# EasyEDA Pro project miniMQ.epro, schematic ArtNet-ETH
Board Name: ArtNet-ETH; Create Date: 2026-09-25; Page Name: P1; Project Name: MagicQ Compact Mini Connect; Schematic Name: ArtNet-ETH; Update Date: 2026-09-25; Company: EasyEDA.com; Page Size: A4; Version: V1.0
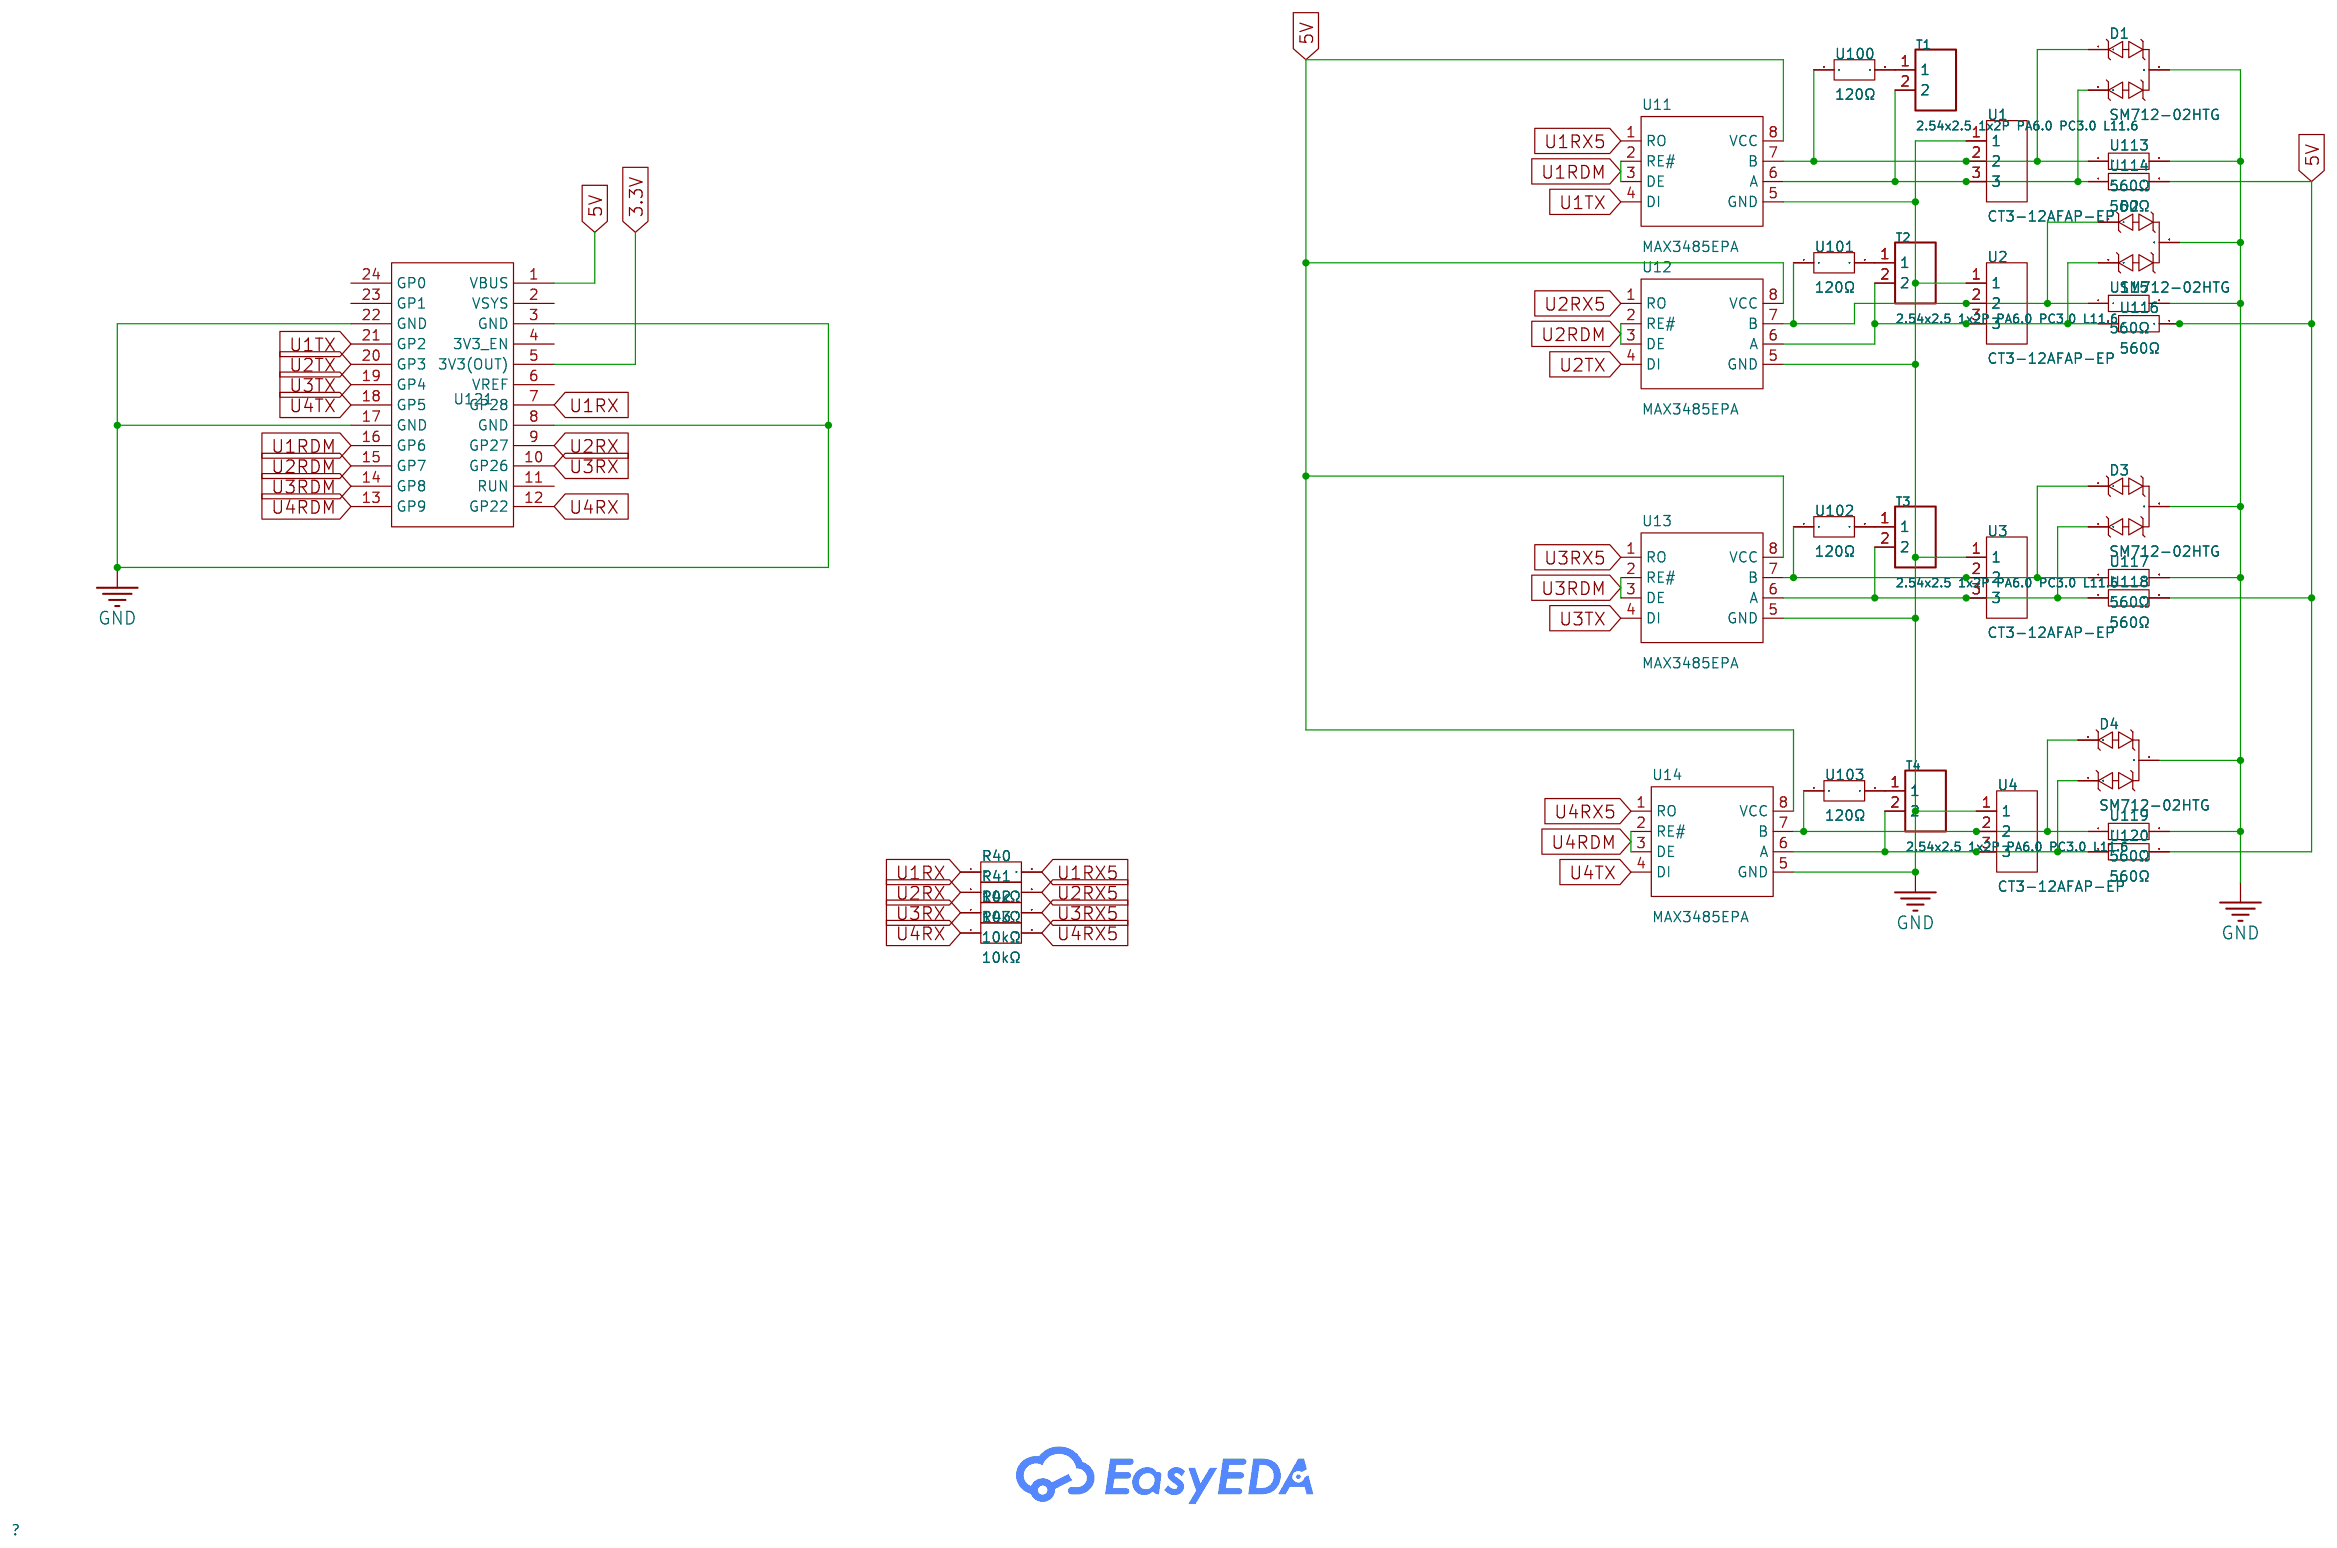
[diagram p8: schematic sheet]

## Parts
D1  SM712-02HTG  [SOT-23-3_L2.9-W1.3-P1.90-LS2.4-BR]
D2  SM712-02HTG  [SOT-23-3_L2.9-W1.3-P1.90-LS2.4-BR]
D3  SM712-02HTG  [SOT-23-3_L2.9-W1.3-P1.90-LS2.4-BR]
D4  SM712-02HTG  [SOT-23-3_L2.9-W1.3-P1.90-LS2.4-BR]
R40  10kΩ  [RES-TH_BD2.3-L3.7-P7.70-D0.9]
R41  10kΩ  [RES-TH_BD2.3-L3.7-P7.70-D0.9]
R42  10kΩ  [RES-TH_BD2.3-L3.7-P7.70-D0.9]
R43  10kΩ  [RES-TH_BD2.3-L3.7-P7.70-D0.9]
T1  2.54x2.5 1x2P PA6.0 PC3.0 L11.6  [HDR-TH_2P-P2.54-V-M-R2-C1-S2.54_3]
T2  2.54x2.5 1x2P PA6.0 PC3.0 L11.6  [HDR-TH_2P-P2.54-V-M-R2-C1-S2.54_3]
T3  2.54x2.5 1x2P PA6.0 PC3.0 L11.6  [HDR-TH_2P-P2.54-V-M-R2-C1-S2.54_3]
T4  2.54x2.5 1x2P PA6.0 PC3.0 L11.6  [HDR-TH_2P-P2.54-V-M-R2-C1-S2.54_3]
U1  CT3-12AFAP-EP  [CONN-TH_CT3-12AFAP-EP]
U2  CT3-12AFAP-EP  [CONN-TH_CT3-12AFAP-EP]
U3  CT3-12AFAP-EP  [CONN-TH_CT3-12AFAP-EP]
U4  CT3-12AFAP-EP  [CONN-TH_CT3-12AFAP-EP]
U11  MAX3485EPA  [DIP-8_L9.8-W6.6-P2.54-LS7.6-BL]
U12  MAX3485EPA  [DIP-8_L9.8-W6.6-P2.54-LS7.6-BL]
U13  MAX3485EPA  [DIP-8_L9.8-W6.6-P2.54-LS7.6-BL]
U14  MAX3485EPA  [DIP-8_L9.8-W6.6-P2.54-LS7.6-BL]
U100  120Ω  [RES-TH_BD2.4-L6.3-P10.30-D0.6]
U101  120Ω  [RES-TH_BD2.4-L6.3-P10.30-D0.6]
U102  120Ω  [RES-TH_BD2.4-L6.3-P10.30-D0.6]
U103  120Ω  [RES-TH_BD2.4-L6.3-P10.30-D0.6]
U113  560Ω  [RES-TH_BD1.9-L3.5-P7.50-D0.5]
U114  560Ω  [RES-TH_BD1.9-L3.5-P7.50-D0.5]
U115  560Ω  [RES-TH_BD1.9-L3.5-P7.50-D0.5]
U116  560Ω  [RES-TH_BD1.9-L3.5-P7.50-D0.5]
U117  560Ω  [RES-TH_BD1.9-L3.5-P7.50-D0.5]
U118  560Ω  [RES-TH_BD1.9-L3.5-P7.50-D0.5]
U119  560Ω  [RES-TH_BD1.9-L3.5-P7.50-D0.5]
U120  560Ω  [RES-TH_BD1.9-L3.5-P7.50-D0.5]
U121  -  [Waveshare RP2350-ETH]

## Library data of the parts
D1-D4 = SM712-02HTG: Polarity:Bidirectional Reverse Stand-Off Voltage (Vrwm):7V；12V Clamping Voltage:26V；18V Peak Pulse Current (Ipp):20A@8/20us Peak Pulse Power Dissipation (Ppp):500W@8/20us Voltage - Breakdown:8V；13.3V Reverse Leakage Current (Ir):1uA level of protection:IE; LCSC Part Name: 双向ESD 12V 7V截止 峰值浪涌电流：20A@8/20us; Supplier Part: C3008057; Manufacturer: MSKSEMI(美森科); Supplier Footprint: SOT-23; JLCPCB Part Class: Extended Part; Datasheet: https://item.szlcsc.com/datasheet/SM712-02HTG/3498455.html; Supplier: LCSC; Polarity: Bidirectional; Reverse Stand-Off Voltage (Vrwm): 7V；12V; Clamping Voltage: 26V；18V; Peak Pulse Current (Ipp): 20A@8/20us; Peak Pulse Power Dissipation (Ppp): 500W@8/20us; Voltage - Breakdown: 8V；13.3V; Reverse Leakage Current (Ir): 1uA; level of protection: IEC 61000-4-4；IEC 61000-4-5；IEC 61000-4-2; Type: ESD; Junction Capacitance: 60pF
R40-R43 = CR1/8W-10K±5%-OT52: Type:Carbon Resister Resistance: Tolerance:±5% Tolerance:±5% Overload Voltage (Max):200V Power(Watts):125mW Temperature Coefficient:±350ppm/℃ Temperature Coefficient:±350ppm/℃ Operating Temperature Range:-55℃~+155℃ Operating Temperature Range:-55℃~+155℃; LCSC Part Name: 碳膜电阻 10kΩ ±5% 125mW; Supplier Part: C2896922; Manufacturer: VO(翔胜); Supplier Footprint: 插件,D2.3xL3.7mm; JLCPCB Part Class: Extended Part; Datasheet: https://atta.szlcsc.com/upload/public/pdf/source/20210803/C2857407_45FF53FE186CAB545115AD37303966CD.pdf; Supplier: LCSC; Type: Carbon Resister; Tolerance: ±5%; Overload Voltage (Max): 200V; Power(Watts): 125mW; Temperature Coefficient: ±350ppm/℃; Operating Temperature Range: -55℃~+155℃
T1-T4 = 2.54x2.5 1x2P PA6.0 PC3.0 L11.6: Pin Structure:1x2P Pitch:2.54mm Circluar Pins/Square Pins:Square pin Mounting Type:Through Hole Number of Rows:1 Number of Pins:2P Current Rating:3A Voltage Rating (Max):500V Contact Material:Brass Contact Plating:Gold Operating Temperature:-40℃~+105℃ Ope; LCSC Part Name: 1x2P 间距:2.54mm 方针 直插; Supplier Part: C55829673; Manufacturer: JMEconn(文章济美); Supplier Footprint: 插件,P=2.54mm; JLCPCB Part Class: Extended Part; Datasheet: https://item.szlcsc.com/datasheet/2.54x2.5%25201x2P%2520PA6.0%2520PC3.0%2520L11.6/59981474.html; Supplier: LCSC; Pin Structure: 1x2P; Pitch: 2.54mm; Circluar Pins/Square Pins: Square pin; Mounting Type: Through Hole; Number of Rows: 1; Number of Pins: 2P; Current Rating: 3A; Voltage Rating (Max): 500V; Contact Material: Brass; Contact Plating: Gold; Operating Temperature: -40℃~+105℃; Color: Black
U1-U4 = CT3-12AFAP-EP: Number of Pins:3P Gender:Female Mounting Type:Right Angle Current Rating:6A Voltage Rating:50V Operating Temperature:-30℃~+80℃ Operating Temperature:-30℃~+80℃; LCSC Part Name: 3Pin 卧式母座 镀金 金属面板 带推柄 螺丝孔接地; Supplier Part: C46594089; Manufacturer: 春生电子; Supplier Footprint: 插件; Datasheet: https://item.szlcsc.com/datasheet/CT3-12AFAP-EP/48729775.html; Supplier: LCSC; Number of Pins: 3P; Gender: Female; Mounting Type: Right Angle; Current Rating: 6A; Voltage Rating: 50V; Operating Temperature: -30℃~+80℃
U11-U14 = MAX3485EPA: Supplier Part: C9900099263; Supplier Footprint: DIP-8P-9.3*6.3-P2.54; JLCPCB Part Class: Extended Part; Supplier: LCSC
U100-U103 = MFR-25FTF52-120R: Type:Metal Film Resistor Resistance:120Ω Tolerance:±1% Tolerance:±1% Power(Watts):250mW Temperature Coefficient:±100ppm/℃ Temperature Coefficient:±100ppm/℃ Operating Temperature:-55℃~+155℃ Operating Temperature:-55℃~+155℃; LCSC Part Name: 金属膜电阻 120Ω ±1% 250mW; Supplier Part: C1371058; Manufacturer: YAGEO(国巨); Supplier Footprint: 插件,D2.4xL6.3mm; JLCPCB Part Class: Extended Part; Datasheet: https://item.szlcsc.com/datasheet/MFR-25FTF52-120R/1461347.html; Supplier: LCSC; Type: Metal Film Resistor; Tolerance: ±1%; Power(Watts): 250mW; Temperature Coefficient: ±100ppm/℃; Operating Temperature: -55℃~+155℃
U113-U120 = FMP-50JB-52-560R: Type:Metal Film Resistor Resistance:560Ω Tolerance:±5% Tolerance:±5% Power(Watts):500mW Temperature Coefficient:±100ppm/℃ Temperature Coefficient:±100ppm/℃ Operating Temperature:-55℃~+155℃ Operating Temperature:-55℃~+155℃; LCSC Part Name: 金属膜电阻 560Ω ±5% 500mW; Supplier Part: C1373629; Manufacturer: YAGEO(国巨); Supplier Footprint: 插件,D1.9xL3.4mm; JLCPCB Part Class: Extended Part; Datasheet: https://item.szlcsc.com/datasheet/FMP-50JB-52-560R/1463918.html; Supplier: LCSC; Type: Metal Film Resistor; Tolerance: ±5%; Power(Watts): 500mW; Temperature Coefficient: ±100ppm/℃; Operating Temperature: -55℃~+155℃
U121 = Waveshare RP2350-ETH

## Nets
3.3V: U121.5(3V3(OUT))
5V: U11.8(VCC) U12.8(VCC) U13.8(VCC) U14.8(VCC) U114.2 U116.2 U118.2 U120.2 U121.1(VBUS)
GND: D1.3 D2.3 D3.3 D4.3 U1.1 U2.1 U3.1 U4.1 U11.5(GND) U12.5(GND) U13.5(GND) U14.5(GND) U113.2 U115.2 U117.2 U119.2 U121.3(GND) U121.8(GND) U121.17(GND) U121.22(GND)
U1RDM: U11.2(RE#) U11.3(DE) U121.16(GP6)
U1RX: R40.1 U121.7(GP28)
U1RX5: R40.2 U11.1(RO)
U1TX: U11.4(DI) U121.21(GP2)
U2RDM: U12.2(RE#) U12.3(DE) U121.15(GP7)
U2RX: R41.1 U121.9(GP27)
U2RX5: R41.2 U12.1(RO)
U2TX: U12.4(DI) U121.20(GP3)
U3RDM: U13.2(RE#) U13.3(DE) U121.14(GP8)
U3RX: R42.1 U121.10(GP26)
U3RX5: R42.2 U13.1(RO)
U3TX: U13.4(DI) U121.19(GP4)
U4RDM: U14.2(RE#) U14.3(DE) U121.13(GP9)
U4RX: R43.1 U121.12(GP22)
U4RX5: R43.2 U14.1(RO)
U4TX: U14.4(DI) U121.18(GP5)
$1N1965: D4.1 U4.2 U14.7(B) U103.1 U119.1
$1N1987: D3.1 U3.2 U13.7(B) U102.1 U117.1
$1N1988: T1.1 U100.2
$1N1989: T2.1 U101.2
$1N1990: T3.1 U102.2
$1N1991: T4.1 U103.2
$1N2000: D4.2 T4.2 U4.3 U14.6(A) U120.1
$1N2001: D3.2 T3.2 U3.3 U13.6(A) U118.1
$1N2002: D1.1 U1.2 U11.7(B) U100.1 U113.1
$1N2003: D1.2 T1.2 U1.3 U11.6(A) U114.1
$1N2006: D2.2 T2.2 U2.3 U12.6(A) U116.1
$1N2007: D2.1 U2.2 U12.7(B) U101.1 U115.1

Not connected (* = marked no-connect by the designer): U121 2(VSYS) 4(3V3_EN) 6(VREF) 11(RUN) 23(GP1) 24(GP0)
